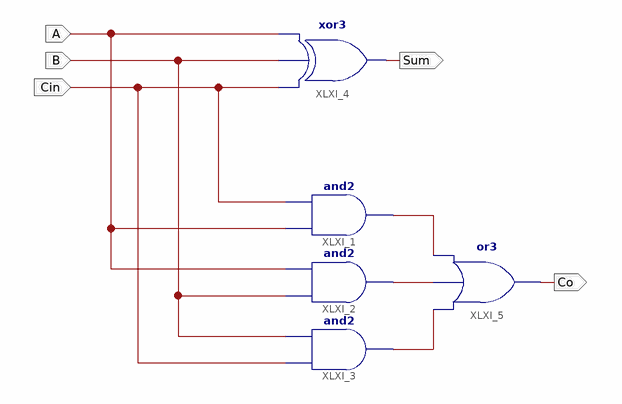
[diagram p0: schematic sheet 1]
// Xilinx ISE schematic FA.sch (virtex6) as structural Verilog: 5 symbols, 5 ports
module FA (
  input  A,
  input  Cin,
  input  B,
  output Sum,
  output Co
);

  wire XLXN_3, XLXN_4, XLXN_5;

  and XLXI_1 (XLXN_3, A, Cin);
  and XLXI_2 (XLXN_4, B, A);
  and XLXI_3 (XLXN_5, Cin, B);
  xor XLXI_4 (Sum, Cin, B, A);
  or XLXI_5 (Co, XLXN_5, XLXN_4, XLXN_3);
endmodule
